# EAGLE board schützboard9 (EAGLE 4.16)
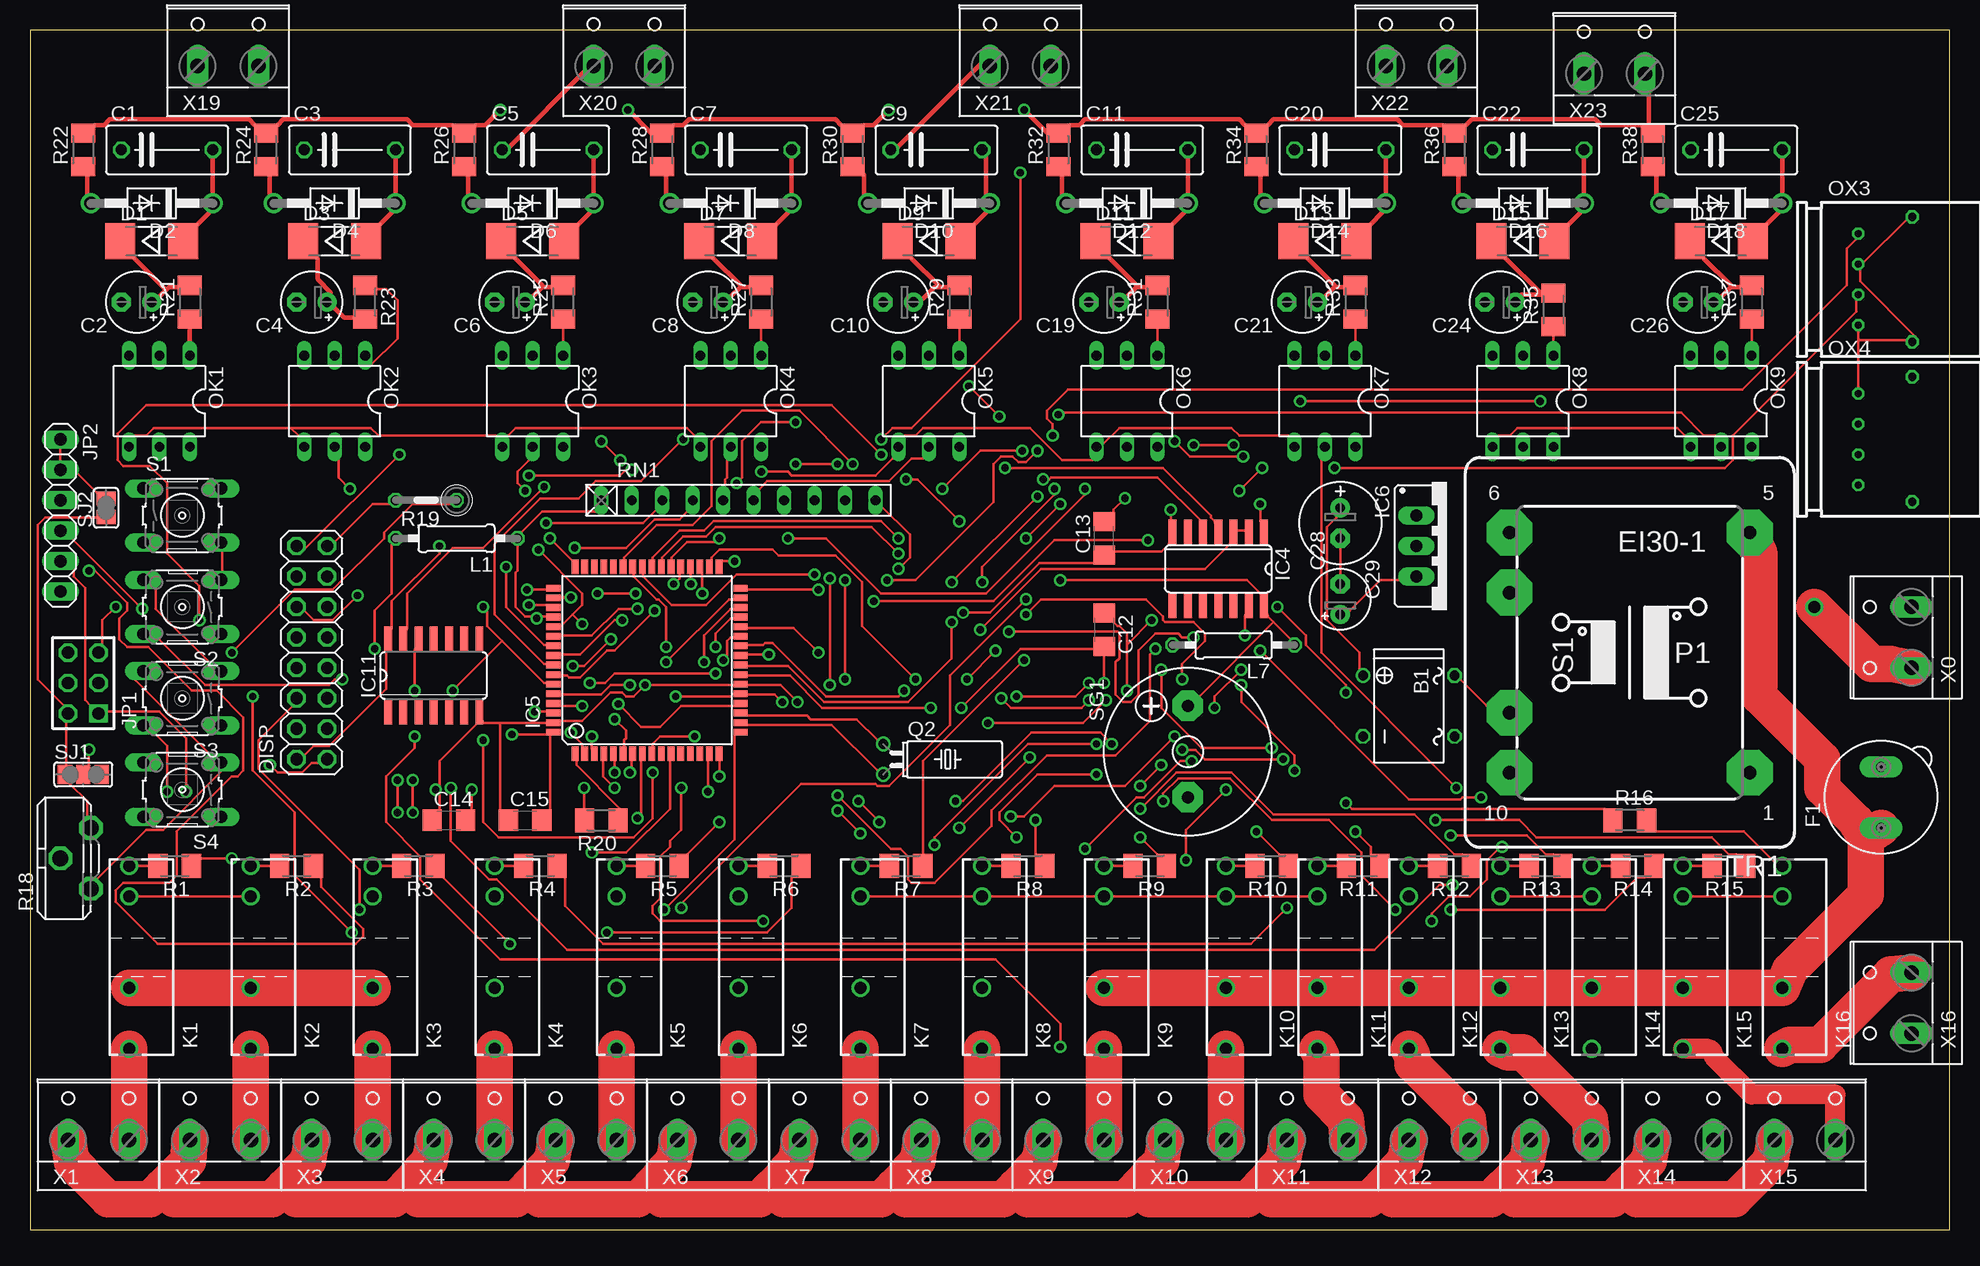
[diagram p1: board, top side]
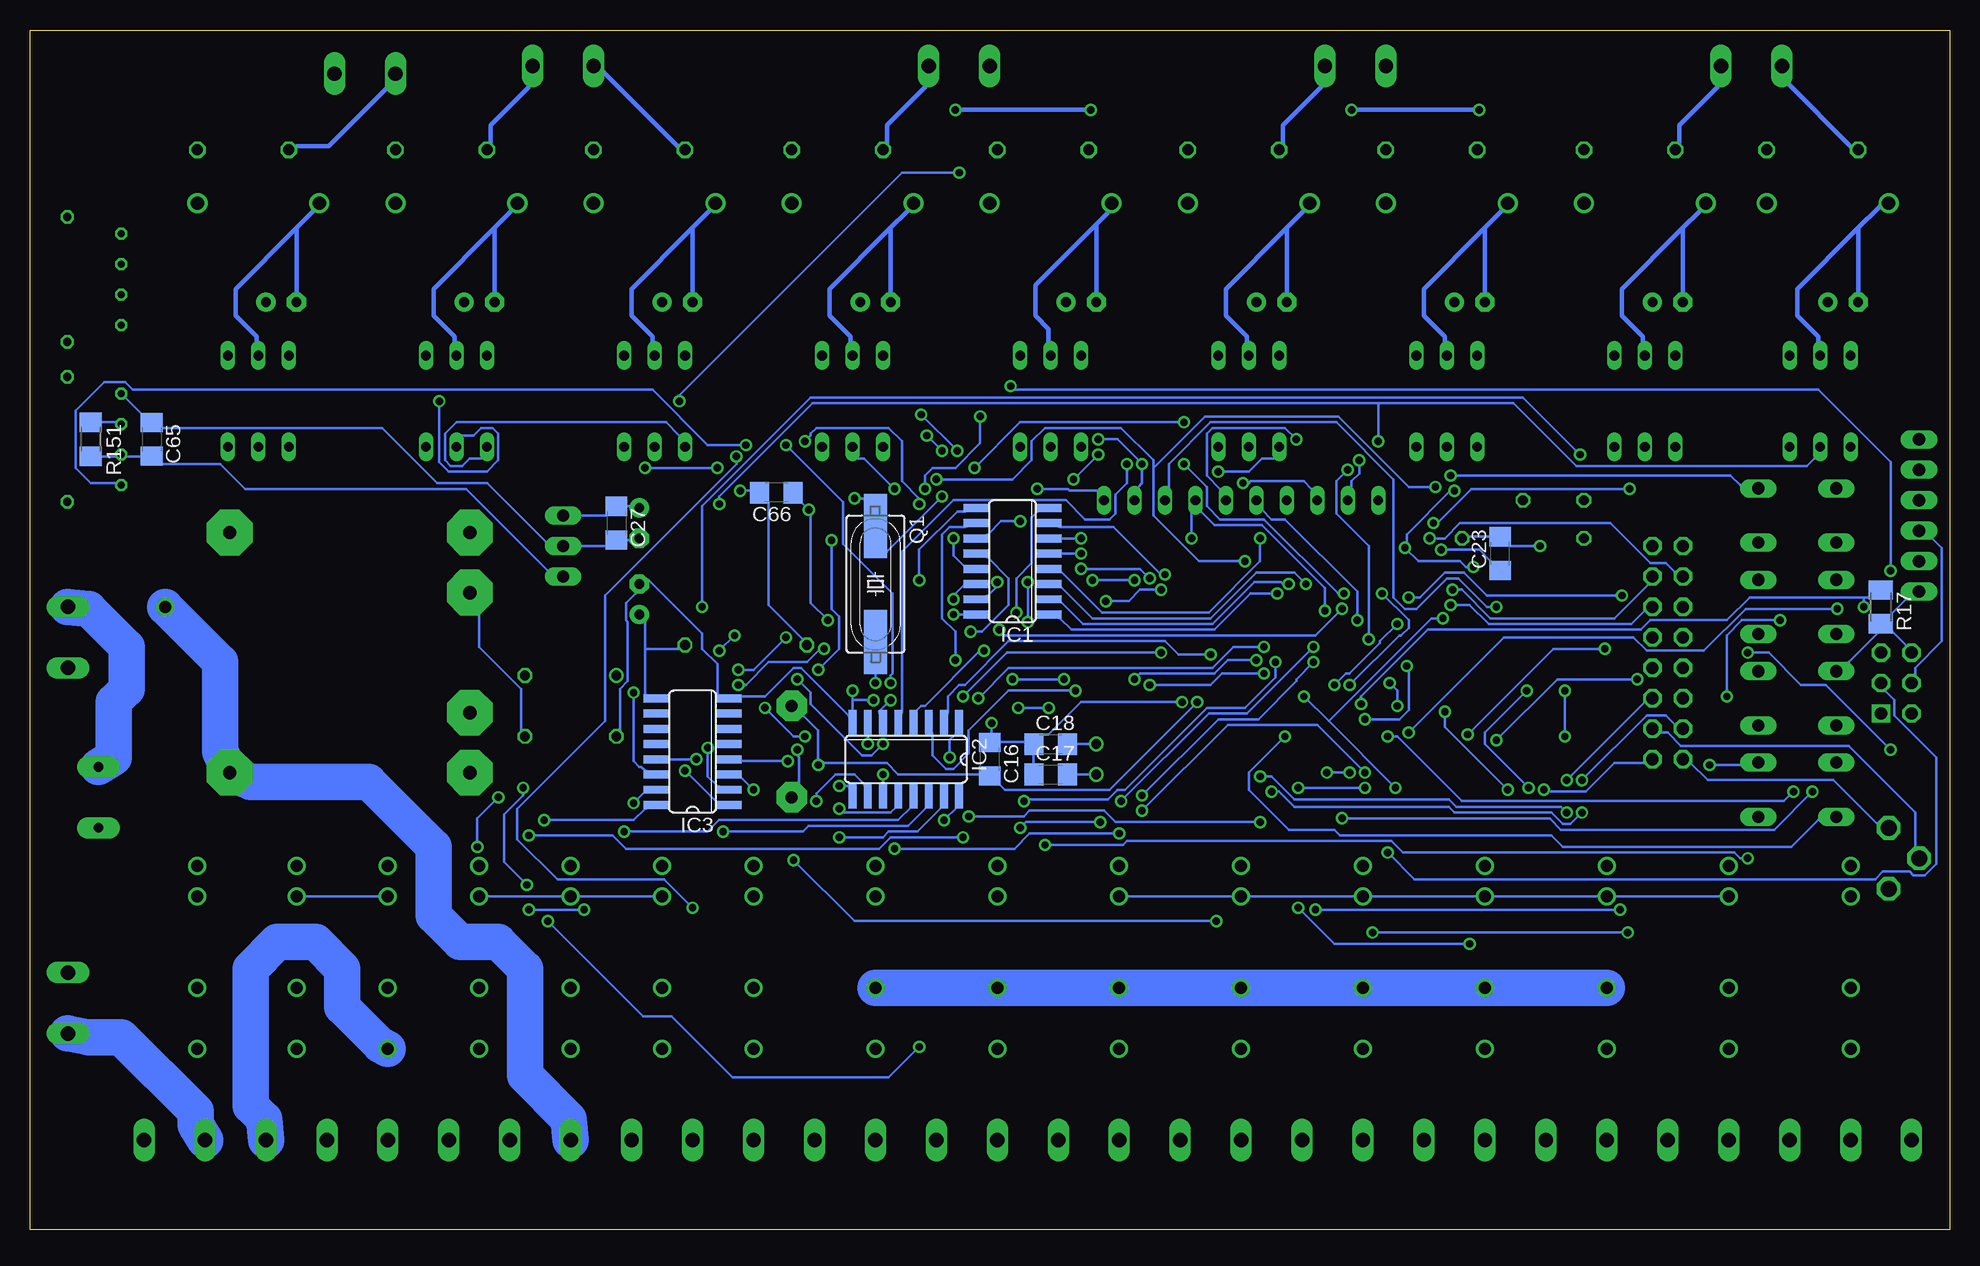
[diagram p2: board, bottom side, seen from below]

Size 160 x 100 mm. Coordinates in mm from the lower left corner, seen from the top.
Outline: 0,0 160,0 160,100 0,100 0,0
Copper layers (1*16): Top 0.035mm / dielectric 1.5mm / Bottom 0.035mm
Design rules "dusch-hmi50": minimum track width 8mil, minimum drill 24mil, track to track 8mil, track to pad 8mil, pad to pad 8mil, via to via 8mil, smd to smd 8mil, copper to edge 10mil, drill to drill 8mil, minimum pad ring 8mil, minimum via ring 8mil, stop-mask expansion 4mil, vias tented up to drill 0mil, thermal gap 10mil
Net classes: 1 supply: width 0.254 mm; 2 eib: width 0.203 mm, drill 0.508 mm; 3 230vpow: width 3.048 mm, drill 1.524 mm, clearance 1 mm; 4 230vsteuer: width 0.381 mm, drill 1.524 mm; 6 vdig: width 0.254 mm

## Footprints (pad centres in the part's own frame; a part is rotated, then mirrored left to right if it is on the bottom)
B-DIL = drill 0.813 round: + -2.54,-3.81 | drill 0.813 octagon: - 2.54,-3.81; AC1 2.54,3.81; AC2 -2.54,3.81
C075-042X103 = drill 0.914 octagon: 1 -3.81,0; 2 3.81,0
E2,5-5 = drill 0.813 pad 1.6 round: + -1.27,0 | drill 0.813 pad 1.6 octagon: - 1.27,0
C1206 = smd 1.6 x 1.8: 1 -1.4,0; 2 1.4,0
E2,5-7 = drill 0.813 pad 1.6 round: + -1.27,0 | drill 0.813 pad 1.6 octagon: - 1.27,0
MELF-MLL41 = smd 2.5 x 3: A 2.625,0; C -2.625,0
DO41-10 = drill 1.118 round: A 5.08,0; C -5.08,0
2X08 = drill 1.016 octagon: 1 -8.89,-1.27; 2 -8.89,1.27; 3 -6.35,-1.27; 4 -6.35,1.27; 5 -3.81,-1.27; 6 -3.81,1.27; 7 -1.27,-1.27; 8 -1.27,1.27; 9 1.27,-1.27; 10 1.27,1.27; 11 3.81,-1.27; 12 3.81,1.27; 13 6.35,-1.27; 14 6.35,1.27; 15 8.89,-1.27; 16 8.89,1.27
19560 = drill 0.813 pad 1.778 long: 1 -2.54,0; 2 2.54,0
SO16 = smd 0.66 x 2.032: 1 -4.445,-3.073; 2 -3.175,-3.073; 3 -1.905,-3.073; 4 -0.635,-3.073; 5 0.635,-3.073; 6 1.905,-3.073; 7 3.175,-3.073; 8 4.445,-3.073; 9 4.445,3.073; 10 3.175,3.073; 11 1.905,3.073; 12 0.635,3.073; 13 -0.635,3.073; 14 -1.905,3.073; 15 -3.175,3.073; 16 -4.445,3.073
SO14 = smd 0.66 x 2.032: 1 -3.81,-3.073; 2 -2.54,-3.073; 3 -1.27,-3.073; 4 0,-3.073; 5 1.27,-3.073; 6 2.54,-3.073; 7 3.81,-3.073; 8 3.81,3.073; 9 2.54,3.073; 10 1.27,3.073; 11 0,3.073; 12 -1.27,3.073; 13 -2.54,3.073; 14 -3.81,3.073
TQFP64 = smd 1.194 x 0.559: 1 -7.8,6; 2 -7.8,5.2; 3 -7.8,4.4; 4 -7.8,3.6; 5 -7.8,2.8; 6 -7.8,2; 7 -7.8,1.2; 8 -7.8,0.4; 9 -7.8,-0.4; 10 -7.8,-1.2; 11 -7.8,-2; 12 -7.8,-2.8; 13 -7.8,-3.6; 14 -7.8,-4.4; 15 -7.8,-5.2; 16 -7.8,-6; 33 7.8,-6; 34 7.8,-5.2; 35 7.8,-4.4; 36 7.8,-3.6; 37 7.8,-2.8; 38 7.8,-2; 39 7.8,-1.2; 40 7.8,-0.4; 41 7.8,0.4; 42 7.8,1.2; 43 7.8,2; 44 7.8,2.8; 45 7.8,3.6; 46 7.8,4.4; 47 7.8,5.2; 48 7.8,6 | smd 0.559 x 1.194: 17 -6,-7.8; 18 -5.2,-7.8; 19 -4.4,-7.8; 20 -3.6,-7.8; 21 -2.8,-7.8; 22 -2,-7.8; 23 -1.2,-7.8; 24 -0.4,-7.8; 25 0.4,-7.8; 26 1.2,-7.8; 27 2,-7.8; 28 2.8,-7.8; 29 3.6,-7.8; 30 4.4,-7.8; 31 5.2,-7.8; 32 6,-7.8; 49 6,7.8; 50 5.2,7.8; 51 4.4,7.8; 52 3.6,7.8; 53 2.8,7.8; 54 2,7.8; 55 1.2,7.8; 56 0.4,7.8; 57 -0.4,7.8; 58 -1.2,7.8; 59 -2,7.8; 60 -2.8,7.8; 61 -3.6,7.8; 62 -4.4,7.8; 63 -5.2,7.8; 64 -6,7.8
78XXS = drill 1.016 long: GND 0,-2.54; IN -2.54,-2.54; OUT 2.54,-2.54
AVR-ISP-6 = drill 1.016 square: 1 -2.54,-1.27 | drill 1.016 octagon: 2 -2.54,1.27; 3 0,-1.27; 4 0,1.27; 5 2.54,-1.27; 6 2.54,1.27
1X06 = drill 1.016 long: 1 -6.35,0; 2 -3.81,0; 3 -1.27,0; 4 1.27,0; 5 3.81,0; 6 6.35,0
S2XXEX = drill 1 round: 1 -7.62,0; 2 -2.54,0; 3 5.08,0; 4 7.62,0
0207/10 = drill 0.813 octagon: 1 -5.08,0; 2 5.08,0
DIL06 = drill 0.813 long: 1 -2.54,-3.81; 2 0,-3.81; 3 2.54,-3.81; 4 2.54,3.81; 5 0,3.81; 6 -2.54,3.81
TORX173 = drill 0.6 octagon: 1 -3.81,0; 2 -1.27,0; 3 1.27,0; 4 3.81,0 | drill 0.7 octagon: 5 5.2,4.5; 6 -5.2,4.5
TOTX173 = drill 0.6 octagon: 1 -3.81,0; 2 -1.27,0; 3 1.27,0; 4 3.81,0 | drill 0.7 octagon: 5 5.2,4.5; 6 -5.2,4.5
HC49UP = smd 5.334 x 1.93: 1 -4.826,0; 2 4.826,0
TC38H = drill 0.813 round: 1 -1.27,0; 2 1.27,0
M1206 = smd 1.6 x 2: 1 -1.4,0; 2 1.4,0
ST10 = drill 1.321 octagon: A -2.54,-1.27; E 2.54,-1.27; S 0,1.27
0207/5V = drill 0.813 octagon: 1 -2.54,0; 2 2.54,0
R1206 = smd 1.6 x 1.803: 1 -1.422,0; 2 1.422,0
RN-10 = drill 0.813 long: 1 -11.43,0; 2 -8.89,0; 3 -6.35,0; 4 -3.81,0; 5 -1.27,0; 6 1.27,0; 7 3.81,0; 8 6.35,0; 9 8.89,0; 10 11.43,0
B3F-10XX = drill 1.016 long: 1 -3.251,2.261; 2 3.251,2.261; 3 -3.251,-2.261; 4 3.251,-2.261
F/CM12P = drill 1.016 pad 2.54 octagon: + 3.81,0; - -3.81,0
SJ_2 = smd 1.168 x 1.6: 1 -1.524,0; 2 0,0; 3 1.524,0
SJ = smd 1.168 x 1.6: 1 -0.762,0; 2 0.762,0
EI30-1 = drill 1.118 pad 3.81 octagon: 1 -10.008,10.008; 5 -10.008,-10.008; 6 10.008,-10.008; 7 10.008,-5.004; 9 10.008,5.004; 10 10.008,10.008
W237-132 = drill 1.194 long: 1 -2.54,-0.635; 2 2.54,-0.635

## Placement (x,y rotation side)
B1  [B-DIL]  114.93,43.65 270 top
C1  MKS-4 47N  [C075-042X103]  11.43,90 0 top
C2  RAD 105 10/63  [E2,5-5]  8.89,77.3 180 top
C3  MKS-4 47N  [C075-042X103]  26.66,90 0 top
C4  RAD 105 10/63  [E2,5-5]  23.49,77.3 180 top
C5  MKS-4 47N  [C075-042X103]  43.18,90 0 top
C6  RAD 105 10/63  [E2,5-5]  40,77.3 180 top
C7  MKS-4 47N  [C075-042X103]  59.69,90 0 top
C8  RAD 105 10/63  [E2,5-5]  56.51,77.3 180 top
C9  MKS-4 47N  [C075-042X103]  75.56,90 0 top
C10  RAD 105 10/63  [E2,5-5]  72.38,77.3 180 top
C11  MKS-4 47N  [C075-042X103]  92.7,90 0 top
C12  [C1206]  89.53,50 270 top
C13  [C1206]  89.53,57.62 90 top
C14  [C1206]  34.92,34.12 0 top
C15  [C1206]  41.27,34.12 0 top
C16  [C1206]  80,39.2 270 bottom
C17  [C1206]  74.92,37.94 0 bottom
C18  [C1206]  74.92,40.48 0 bottom
C19  RAD 105 10/63  [E2,5-5]  89.53,77.3 180 top
C20  MKS-4 47N  [C075-042X103]  109.21,90 0 top
C21  RAD 105 10/63  [E2,5-5]  106.04,77.3 180 top
C22  MKS-4 47N  [C075-042X103]  125.72,90 0 top
C23  [C1206]  37.46,56.35 90 bottom
C24  RAD 105 10/63  [E2,5-5]  122.55,77.3 180 top
C25  MKS-4 47N  [C075-042X103]  142.23,90 0 top
C26  RAD 105 10/63  [E2,5-5]  139.06,77.3 180 top
C27  X7R-G1206 100N  [C1206]  111.12,58.89 270 bottom
C28  RAD 105 10/63  [E2,5-5]  109.21,52.54 90 top
C29  RAD 105 220/16  [E2,5-7]  109.21,58.89 270 top
C65  X7R-G1206 100N  [C1206]  149.85,65.88 270 bottom
C66  X7R-G1206 100N  [C1206]  97.78,61.43 180 bottom
D1  SMD 1N 4007  [MELF-MLL41]  10.16,82.39 0 top
D2  P6KE 440A  [DO41-10]  10.16,85.56 180 top
D3  SMD 1N 4007  [MELF-MLL41]  25.39,82.39 0 top
D4  P6KE 440A  [DO41-10]  25.39,85.56 180 top
D5  SMD 1N 4007  [MELF-MLL41]  41.91,82.39 0 top
D6  P6KE 440A  [DO41-10]  41.91,85.56 180 top
D7  SMD 1N 4007  [MELF-MLL41]  58.41,82.39 0 top
D8  P6KE 440A  [DO41-10]  58.41,85.56 180 top
D9  SMD 1N 4007  [MELF-MLL41]  74.92,82.39 0 top
D10  P6KE 440A  [DO41-10]  74.92,85.56 180 top
D11  SMD 1N 4007  [MELF-MLL41]  91.44,82.39 0 top
D12  P6KE 440A  [DO41-10]  91.44,85.56 180 top
D13  SMD 1N 4007  [MELF-MLL41]  107.94,82.39 0 top
D14  P6KE 440A  [DO41-10]  107.94,85.56 180 top
D15  SMD 1N 4007  [MELF-MLL41]  124.45,82.39 0 top
D16  P6KE 440A  [DO41-10]  124.45,85.56 180 top
D17  SMD 1N 4007  [MELF-MLL41]  140.97,82.39 0 top
D18  P6KE 440A  [DO41-10]  140.97,85.56 180 top
DISP  [2X08]  23.49,48.09 90 top
F1  [19560]  154.3,36.03 90 top
IC1  ULN2003AD  [SO16]  78.1,55.71 90 bottom
IC2  ULN2003AD  [SO16]  86.99,39.2 180 bottom
IC3  ULN2003AD  [SO16]  104.77,39.84 90 bottom
IC4  4066D  [SO14]  99.05,55.08 180 top
IC5  MEGA64-A  [TQFP64]  51.43,47.46 90 top
IC6  [78XXS]  118.1,56.98 270 top
IC11  74HC14D  [SO14]  33.65,46.19 0 top
JP1  AVR-ISP-6  [AVR-ISP-6]  4.44,45.55 90 top
JP2  [1X06]  2.54,59.52 270 top
K1  S202S12  [S2XXEX]  8.25,22.7 90 top
K2  S202S12  [S2XXEX]  18.41,22.7 90 top
K3  S202S12  [S2XXEX]  28.57,22.7 90 top
K4  S202S12  [S2XXEX]  38.73,22.7 90 top
K5  S202S12  [S2XXEX]  48.89,22.7 90 top
K6  S202S12  [S2XXEX]  59.05,22.7 90 top
K7  S202S12  [S2XXEX]  69.21,22.7 90 top
K8  S202S12  [S2XXEX]  79.37,22.7 90 top
K9  S202S12  [S2XXEX]  89.53,22.7 90 top
K10  S202S12  [S2XXEX]  99.69,22.7 90 top
K11  S202S12  [S2XXEX]  107.31,22.7 90 top
K12  S202S12  [S2XXEX]  114.93,22.7 90 top
K13  S202S12  [S2XXEX]  122.55,22.7 90 top
K14  S202S12  [S2XXEX]  130.17,22.7 90 top
K15  S202S12  [S2XXEX]  137.79,22.7 90 top
K16  S202S12  [S2XXEX]  146.04,22.7 90 top
L1  [0207/10]  35.55,57.62 180 top
L7  SMCC 47µ  [0207/10]  100.32,48.73 180 top
OK1  CNY17  [DIL06]  10.79,69.05 180 top
OK2  CNY17  [DIL06]  25.39,69.05 180 top
OK3  CNY17  [DIL06]  41.91,69.05 180 top
OK4  CNY17  [DIL06]  58.41,69.05 180 top
OK5  CNY17  [DIL06]  74.92,69.05 180 top
OK6  CNY17  [DIL06]  91.44,69.05 180 top
OK7  CNY17  [DIL06]  107.94,69.05 180 top
OK8  CNY17  [DIL06]  124.45,69.05 180 top
OK9  CNY17  [DIL06]  140.97,69.05 180 top
OX3  TORX173  [TORX173]  152.39,79.21 270 top
OX4  TOTX173  [TOTX173]  152.39,65.88 270 top
Q1  [HC49UP]  89.53,53.81 270 bottom
Q2  [TC38H]  71.11,39.2 270 top
R1  [M1206]  12.06,30.31 180 top
R2  [M1206]  22.22,30.31 180 top
R3  [M1206]  32.38,30.31 180 top
R4  [M1206]  42.54,30.31 180 top
R5  [M1206]  52.7,30.31 180 top
R6  [M1206]  62.86,30.31 180 top
R7  [M1206]  73.02,30.31 180 top
R8  [M1206]  83.18,30.31 180 top
R9  [M1206]  93.34,30.31 180 top
R10  [M1206]  103.5,30.31 180 top
R11  [M1206]  111.12,30.31 180 top
R12  [M1206]  118.74,30.31 180 top
R13  [M1206]  126.36,30.31 180 top
R14  [M1206]  133.98,30.31 180 top
R15  [M1206]  141.6,30.31 180 top
R16  [M1206]  133.34,34.12 0 top
R17  20k  [M1206]  5.71,51.91 270 bottom
R18  [ST10]  3.8,30.95 90 top
R19  [0207/5V]  33.02,60.8 180 top
R20  20k  [M1206]  47.62,34.12 180 top
R21  SMD 1/4W 6,8k  [M1206]  13.33,77.3 90 top
R22  SMD 1/4W 2,7k  [M1206]  4.44,90 90 top
R23  SMD 1/4W 6,8k  [M1206]  27.93,77.3 270 top
R24  SMD 1/4W 2,7k  [M1206]  19.68,90 90 top
R25  SMD 1/4W 6,8k  [M1206]  44.45,77.3 90 top
R26  SMD 1/4W 2,7k  [M1206]  36.19,90 90 top
R27  SMD 1/4W 6,8k  [M1206]  60.96,77.3 90 top
R28  SMD 1/4W 2,7k  [M1206]  52.7,90 90 top
R29  SMD 1/4W 6,8k  [M1206]  77.46,77.3 90 top
R30  SMD 1/4W 2,7k  [M1206]  68.57,90 90 top
R31  SMD 1/4W 6,8k  [M1206]  93.97,77.3 90 top
R32  SMD 1/4W 2,7k  [M1206]  85.72,90 90 top
R33  SMD 1/4W 6,8k  [M1206]  110.48,77.3 90 top
R34  SMD 1/4W 2,7k  [M1206]  102.23,90 90 top
R35  SMD 1/4W 6,8k  [M1206]  126.99,76.67 90 top
R36  SMD 1/4W 2,7k  [M1206]  118.74,90 90 top
R37  SMD 1/4W 6,8k  [M1206]  143.5,77.3 90 top
R38  SMD 1/4W 2,7k  [M1206]  135.25,90 90 top
R151  SMD 1/4W 8k2  [R1206]  154.94,65.88 270 bottom
RN1  [RN-10]  59.05,60.8 0 top
S1  [B3F-10XX]  12.7,59.52 0 top
S2  [B3F-10XX]  12.7,51.91 180 top
S3  [B3F-10XX]  12.7,44.28 180 top
S4  [B3F-10XX]  12.7,36.66 180 top
SG1  F/CM12P  [F/CM12P]  96.52,39.84 90 top
SJ1  [SJ_2]  4.44,37.94 0 top
SJ2  [SJ]  6.34,60.16 90 top
TR1  [EI30-1]  133.34,48.09 180 top
X0  [W237-132]  156.2,49.37 90 top
X1  [W237-132]  5.71,8.09 0 top
X2  [W237-132]  15.87,8.09 0 top
X3  [W237-132]  26.03,8.09 0 top
X4  [W237-132]  36.19,8.09 0 top
X5  [W237-132]  46.35,8.09 0 top
X6  [W237-132]  56.51,8.09 0 top
X7  [W237-132]  66.67,8.09 0 top
X8  [W237-132]  76.83,8.09 0 top
X9  [W237-132]  86.99,8.09 0 top
X10  [W237-132]  97.15,8.09 0 top
X11  [W237-132]  107.31,8.09 0 top
X12  [W237-132]  117.47,8.09 0 top
X13  [W237-132]  127.63,8.09 0 top
X14  [W237-132]  137.79,8.09 0 top
X15  [W237-132]  147.95,8.09 0 top
X16  [W237-132]  156.2,18.88 90 top
X19  [W237-132]  16.5,97.62 0 top
X20  [W237-132]  49.53,97.62 0 top
X21  [W237-132]  82.55,97.62 0 top
X22  [W237-132]  115.56,97.62 0 top
X23  [W237-132]  132.07,96.99 0 top

## Tracks (layer width: path | path; a pad name or v marks a point on that pad's centre or on a via)
+5V  (via drill 0.61)
  Top 0.203: 42.22,51.11 41.27,51.11 40.48,51.91 40.48,54.76 40.64,54.92 40.64,57.14 L1.1 40.95,58.1 42.7,59.84 47.14,59.84 RN1.1 | 42.22,51.11 43.18,51.11 IC5.52 | DISP.2 22.86,39.52 23.65,40.32 24.92,40.32 29.68,45.08 29.68,48.25 IC11.14 30.16,50.16 30.16,52.38 34.13,56.35 v34.13,56.98 | SJ2.1 5.55,59.37 1.27,59.37 0.63,58.73 0.63,45.87 2.85,43.65 JP1.2 3.01,42.38 3.01,38.73 SJ1.1 3.33,37.14 4.76,35.71 4.76,34.44 R18.E | IC6.OUT 114.14,54.13 112.55,54.13 110.01,51.59 C28.+ | v62.7,43.97 62.07,44.6 59.69,44.6 IC5.21 58.73,44.76 58.41,44.44 v53.81,44.44 | v46.19,36.82 46.19,35.08 R20.2 | v94.29,38.73 v92.55,36.98 | v85.88,54.13 101.44,54.13 102.55,53.02 IC4.14 103.18,51.11 103.66,50.63 | 103.66,50.63 105.09,49.21 L7.1 | 103.66,50.63 97.47,44.44 SG1.+ | 42.22,51.11 v42.22,50.95
  Bottom 0.203: L1.1 40.16,57.78 38.25,57.78 C23.2 36.67,56.98 v34.13,56.98 | DISP.2 21.58,38.89 20.16,37.46 9.68,37.46 6.03,33.81 R18.E | R151.2 154.14,64.45 152.87,64.45 OX4.3 151.92,64.45 150.65,64.45 C65.2 149.06,63.81 144.14,63.81 142.08,61.75 123.66,61.75 116.83,54.92 IC6.OUT | 108.74,48.41 108.74,50.63 C28.+ | 108.74,48.41 108.74,44.6 IC3.9 | v62.7,43.97 70,36.66 78.73,36.66 79.21,37.14 C16.2 80.8,37.94 87.62,37.94 88.58,38.89 93.82,38.89 v94.29,38.73 94.29,41.59 95.56,42.86 SG1.+ | 51.75,42.38 v53.81,44.44 | 51.75,42.38 v46.19,36.82 | v92.55,36.98 91.75,36.98 IC2.9 | v85.88,54.13 85.88,56.67 82.7,59.84 82.07,59.84 IC1.9 | 108.74,48.41 105.88,48.41 L7.1 | v42.22,50.95 43.18,50.95 51.75,42.38
GND  (via drill 0.61)
  Top 0.203: S3.4 8.73,45.87 14.92,39.68 S4.3 16.03,38.25 11.11,33.33 9.68,33.33 5.55,29.2 R18.A | v20,38.73 20.63,38.09 22.7,38.09 23.49,38.89 24.12,38.89 DISP.1 | 45.24,51.27 46.03,52.06 46.03,53.02 v42.38,56.67 | 45.24,51.27 44.29,50.32 44.13,50.32 IC5.53 | 39.21,42.22 37.78,42.22 IC11.7 37.3,42.22 34.13,39.05 34.13,36.66 | 39.21,42.22 43.18,42.22 IC5.63 44.13,42.38 46.03,42.38 48.41,44.76 49.37,44.76 49.68,44.44 50.32,44.44 v51.27,45.4 58.73,45.4 IC5.22 59.69,45.4 62.54,45.4 v63.97,43.97 | 34.13,36.66 34.13,34.92 C14.1 | 39.21,42.22 39.21,34.92 C15.1 | v46.03,50.48 45.24,51.27 | 45.24,51.27 | v33.81,36.66 34.13,36.66 | v95.09,60 95.09,59.05 IC4.7 94.93,57.14 94.29,56.51 90.32,56.51 C13.1 88.74,55.56 84.13,55.56 80,51.43 v77.78,51.43 | OX3.6 156.52,84.29 152.87,80.64 OX3.2 152.55,80 152.55,79.05 157.16,74.45 OX3.5 156.36,74.13 152.39,74.13 | 152.39,74.13 152.39,70.16 OX4.1 | 152.39,74.13 152.39,74.92 OX3.4 | v91.44,44.92 91.44,48.73 | 91.44,48.73 91.44,49.68 90.8,50.32 90.64,50.32 90.32,50.63 C12.1 | C29.- 109.21,56.83 109.21,54.6 C28.- | 91.44,48.73 v93.5,50.79 | v79.85,42.22 87.78,42.22 v89.69,44.13
  Bottom 0.203: R17.2 4.76,49.84 3.49,48.57 JP1.6 | S3.4 8.41,47.3 5.87,49.84 R17.2 | v20,38.73 17.46,38.73 S4.3 | JP2.6 3.65,52.54 4.92,51.27 R17.2 | v42.38,56.67 39.21,56.67 38.25,55.71 C23.1 | C17.1 76.35,38.73 76.35,39.68 C18.1 | C18.1 76.99,40.63 79.21,40.63 C16.1 79.85,41.27 v79.85,42.22 | v63.97,43.97 72.38,43.97 75.08,41.27 75.56,41.27 C18.1 | v46.03,50.48 47.46,49.05 47.46,48.89 50,46.35 50.32,46.35 v51.27,45.4 | v33.81,36.66 33.65,36.51 30.32,36.51 27.93,38.89 25.39,38.89 DISP.1 | C66.1 95.72,60.64 v95.09,60 94.93,59.52 94.93,52.22 v93.5,50.79 | v77.78,51.43 77.78,54.29 76.51,55.56 76.51,59.37 76.04,59.84 IC1.8 | OX4.1 150.65,67.94 C65.1 149.06,66.83 130.65,66.83 126.04,62.22 121.91,62.22 116.99,57.3 IC6.GND 114.14,56.98 111.91,56.98 C27.2 110.33,57.46 110.01,57.46 C29.- | 91.44,44.13 91.44,43.17 IC2.8 91.75,42.86 95.72,46.82 96.36,46.82 98.74,44.44 100.8,44.44 IC3.8 102.71,44.6 102.71,47.14 103.98,48.41 103.98,49.68 108.42,54.13 C28.- 109.53,53.02 110.33,52.22 110.33,50.79 110.17,50.63 110.17,45.71 110.8,45.08 110.8,41.59 B1.- | 91.44,44.13 v91.44,44.92 | v89.69,44.13 91.44,44.13
N$1
  Top 0.203: SJ2.2 5.55,61.43 3.96,63.02 JP2.2 2.54,63.97 2.54,65.24 JP2.1
N$2  (via drill 0.61)
  Top 0.203: v56.03,53.02 56.03,54.76 IC5.35
  Bottom 0.203: v56.03,53.02 58.26,53.02 61.27,50 73.18,50 74.13,50.95 IC1.1
N$3  (via drill 0.61)
  Top 0.203: v55.08,53.81 55.08,54.76 IC5.36
  Bottom 0.203: v55.08,53.81 55.56,53.81 55.72,53.97 57.94,53.97 61.43,50.48 72.23,50.48 74.13,52.38 IC1.2
N$4  (via drill 0.61)
  Top 0.203: v53.65,53.81 54.13,54.29 54.13,54.76 IC5.37
  Bottom 0.203: v53.65,53.81 54.61,54.76 57.78,54.76 61.59,50.95 71.43,50.95 74.13,53.65 IC1.3
N$5  (via drill 0.61)
  Top 0.203: v57.46,57.62 57.15,57.3 54.76,57.3 53.49,56.03 53.49,55.71 IC5.38
  Bottom 0.203: v57.46,57.62 57.46,55.71 61.75,51.43 70.64,51.43 74.13,54.92 IC1.4
N$6  (via drill 0.61)
  Top 0.203: v16.82,30.95 14.12,30.95 R1.1 | v75.4,32.06 75.4,32.7 83.18,40.48 v88.89,40.48 | v96.04,45.87 96.04,47.14 97.94,49.05 97.94,49.68 96.99,50.63 94.61,50.63 94.45,50.79 94.45,51.11 93.02,52.54 84.29,52.54 v83.02,51.27
  Bottom 0.203: v16.82,30.95 17.46,30.95 17.93,31.43 45.56,31.43 46.51,32.38 68.57,32.38 68.89,32.06 v75.4,32.06 | v88.89,40.48 89.85,39.52 90.64,39.52 94.93,43.81 94.93,44.76 v96.04,45.87 | v83.02,51.27 82.07,51.27 IC1.16
N$7  (via drill 0.61)
  Top 0.203: v4.92,54.92 5.39,54.92 8.09,52.22 8.09,51.59 7.46,50.95 7.46,49.21 8.09,48.57 9.84,48.57 13.49,44.92 15.55,44.92 17.77,42.7 17.77,38.25 17.3,37.78 16.82,37.78 12.22,33.17 12.22,29.52 11.58,28.89 7.77,28.89 7.14,28.25 7.14,27.3 10.63,23.81 27.14,23.81 27.78,24.44 27.78,25.08 24.28,28.57 24.28,29.36 R2.1 | v78.26,70.32 v80.8,67.78 | v85.4,61.75 85.4,61.27 79.37,55.24 v79.37,53.97
  Bottom 0.203: v4.92,54.92 4.92,63.97 10.95,70 77.94,70 v78.26,70.32 | v80.8,67.78 80.8,65.56 82.86,63.49 84.77,63.49 85.4,62.86 v85.4,61.75 | v79.37,53.97 79.37,53.65 80.16,52.86 IC1.15
N$8  (via drill 0.61)
  Top 0.203: v40,23.81 34.44,29.36 R3.1 | v54.29,26.82 54.29,27.14 64.29,37.14 70.48,37.14 70.64,36.98 71.59,36.98 76.67,42.06 76.67,46.19 v83.02,52.54
  Bottom 0.203: v40,23.81 51.27,23.81 v54.29,26.82 | v83.02,52.54 83.02,52.86 82.07,53.81 IC1.14
N$9  (via drill 0.61)
  Top 0.203: v104.77,26.82 101.75,23.81 47.78,23.81 44.6,26.98 44.6,29.36 R4.1 | v101.12,64.45 96.67,64.45 v95.4,65.72 | v85.88,60.48 v83.02,57.62
  Bottom 0.203: v104.77,26.82 107.15,29.2 116.04,29.2 119.38,32.54 119.38,35.08 112.07,42.38 112.07,52.86 101.12,63.81 v101.12,64.45 | v95.4,65.72 94.93,66.19 94.93,66.35 94.45,66.83 88.42,66.83 87.31,65.72 87.31,62.38 85.88,60.95 v85.88,60.48 | v83.02,57.62 83.02,56.19 82.07,55.24 IC1.13
N$10  (via drill 0.61)
  Top 0.203: v57.46,33.97 54.76,31.27 R5.1 | v81.75,34.44 82.86,34.44 85.4,36.98 91.28,36.98 v95.4,41.11 | v98.74,43.49 98.74,44.44 v100.96,46.67 | v96.99,49.37 96.04,49.37 95.72,49.68 93.82,49.68 92.39,48.25 92.39,44.6 91.75,43.97 91.12,43.97 90.48,44.6 90.48,47.3 90.8,47.62 90.8,49.68 90.64,49.84 v81.59,49.84
  Bottom 0.203: v57.46,33.97 69.53,33.97 70.48,34.92 76.67,34.92 77.15,34.44 v81.75,34.44 | v95.4,41.11 96.36,41.11 v98.74,43.49 | v100.96,46.67 99.69,46.67 v96.99,49.37 | v81.59,49.84 80.64,49.84 78.42,52.06 78.42,54.29 80.16,56.03 IC1.12
N$11  (via drill 0.61)
  Top 0.203: v48.1,24.76 61.43,24.76 63.5,26.82 63.5,29.36 R6.1 | v26.82,24.76 22.06,29.52 22.06,34.76 18.57,38.25 v18.57,44.44 | v14.12,50.79 14.12,53.65 11.43,56.35 11.43,62.22 10,63.65 7.77,63.65 7.3,64.13 7.3,66.35 9.68,68.73 66.83,68.73 v70.96,64.61 | v73.02,62.54 73.97,62.54 v77.46,59.05
  Bottom 0.203: v26.82,24.76 v48.1,24.76 | v18.57,44.44 18.57,49.52 17.3,50.79 v14.12,50.79 | v70.96,64.61 v73.02,62.54 | v77.46,59.05 79.05,59.05 80.16,57.94 IC1.11
N$12  (via drill 0.61)
  Top 0.203: v82.86,47.46 74.45,39.05 74.45,31.27 R7.1
  Bottom 0.203: v82.86,47.46 82.86,49.84 83.97,50.95 83.97,57.94 83.34,58.57 82.07,58.57 IC1.10
N$13  (via drill 0.61)
  Top 0.203: v83.81,34.12 83.81,31.27 R8.1
  Bottom 0.203: v83.81,34.12 82.7,35.24 IC2.16
N$14  (via drill 0.61)
  Top 0.203: v92.55,32.7 93.97,31.27 R9.1
  Bottom 0.203: v92.55,32.7 88.89,32.7 88.42,33.17 86.04,33.17 83.97,35.24 IC2.15
N$15  (via drill 0.61)
  Top 0.203: v102.23,33.17 104.13,31.27 R10.1
  Bottom 0.203: v102.23,33.17 95.56,33.17 95.09,33.65 86.83,33.65 85.24,35.24 IC2.14
N$16  (via drill 0.61)
  Top 0.203: v110.48,33.17 111.75,31.9 111.75,31.27 R11.1
  Bottom 0.203: v110.48,33.17 103.5,33.17 102.55,34.12 87.62,34.12 86.51,35.24 IC2.13
N$17
  Top 0.203: R1.2 10,30.31 8.89,30.31 K1.4
N$18
  Top 0.203: R2.2 20.16,30.31 19.04,30.31 K2.4
N$19
  Top 0.203: R3.2 30.32,30.31 29.2,30.31 K3.4
N$20
  Top 0.203: R4.2 40.48,30.31 39.37,30.31 K4.4
N$21
  Top 0.203: R5.2 50.64,30.31 49.53,30.31 K5.4
N$22
  Top 0.203: R6.2 60.8,30.31 59.69,30.31 K6.4
N$23
  Top 0.203: R7.2 70.96,30.31 69.84,30.31 K7.4
N$24
  Top 0.203: R8.2 81.12,30.31 80,30.31 K8.4
N$25
  Top 0.203: R9.2 91.28,30.31 90.16,30.31 K9.4
N$26
  Top 0.203: R10.2 101.44,30.31 100.32,30.31 K10.4
N$27
  Top 0.203: R11.2 109.06,30.31 107.94,30.31 K11.4
N$28  (via drill 0.61)
  Top 0.203: v92.55,35.08 95.56,38.09 100.17,38.09 103.66,34.6 115.41,34.6 118.74,31.27 119.38,31.27 R12.1
  Bottom 0.203: v92.55,35.08 92.23,34.76 88.26,34.76 87.78,35.24 IC2.12
N$29
  Top 0.203: R12.2 116.68,30.31 115.56,30.31 K12.4
N$30  (via drill 0.61)
  Top 0.203: v104.45,39.2 97.94,39.2 97.15,40 v96.04,40
  Bottom 0.203: v104.45,39.2 106.83,39.2 IC3.13 | v96.04,40 96.04,39.52 95.88,39.36 95.88,37.14 SG1.-
N$31  (via drill 0.61)
  Top 0.203: v118.42,32.85 124.77,32.85 126.36,31.27 126.99,31.27 R13.1 | v82.23,32.7 80.8,34.12 80.8,34.76 83.97,37.94 v88.89,37.94
  Bottom 0.203: v118.42,32.85 111.44,32.85 110.33,31.74 89.21,31.74 88.26,32.7 v82.23,32.7 | v88.89,37.94 88.89,37.14 IC2.11
N$32
  Bottom 3.048: F1.2 153.03,39.36 153.03,43.97 151.92,45.08 151.92,48.57 155.09,51.75 X0.2
N$33  (via drill 0.61)
  Top 0.203: v118.42,26.66 131.28,26.66 133.98,29.36 134.62,29.36 R14.1 | v113.82,26.66 110.96,29.52 110.96,31.43 108.26,34.12 103.5,34.12 100.01,37.62 95.72,37.62 94.45,36.35 v94.45,35.71
  Bottom 0.203: v113.82,26.66 v118.42,26.66 | v94.45,35.71 94.45,36.35 92.86,37.94 91.28,37.94 90.48,37.14 IC2.10
N$34
  Top 3.048: K1.1 8.25,14.44 8.25,9.2 X1.2
N$35
  Top 3.048: K2.1 18.41,14.44 18.41,9.2 X2.2
N$36
  Top 3.048: K3.1 28.57,14.44 28.57,9.2 X3.2
N$37
  Top 3.048: K4.1 38.73,14.44 38.73,9.2 X4.2
N$38
  Top 3.048: K5.1 48.89,14.44 48.89,9.2 X5.2
N$39
  Top 3.048: K6.1 59.05,14.44 59.05,9.2 X6.2
N$40
  Top 3.048: K7.1 69.21,14.44 69.21,9.2 X7.2
N$41
  Top 3.048: K8.1 79.37,14.44 79.37,9.2 X8.2
N$42
  Top 3.048: K11.1 107.63,14.44 107.63,11.27 109.69,9.2 X11.2
N$43
  Top 3.048: K12.1 115.25,14.44 115.25,13.81 119.85,9.2 X12.2
N$44  (via drill 0.61)
  Top 0.203: v117.15,34.12 124.14,34.12 125.57,32.7 140.17,32.7 141.6,31.27 142.23,31.27 R15.1
  Bottom 0.203: v117.15,34.12 109.69,34.12 108.74,35.08 IC3.16
N$45
  Top 3.048: K10.1 99.69,14.44 99.69,9.2 X10.2
N$46
  Top 3.048: K9.1 89.53,14.44 89.53,9.2 X9.2
N$47  (via drill 0.61)
  Top 0.203: v109.69,35.55 110.17,35.08 131.28,35.08 R16.1
  Bottom 0.203: v109.69,35.55 108.74,36.51 IC3.15
N$48  (via drill 0.61)
  Top 0.203: v46.83,31.43 49.68,31.43 53.34,35.08 53.34,39.2 IC5.11
  Bottom 0.203: v46.83,31.43 44.6,29.2 6.19,29.2 5.55,29.84 3.33,29.84 3.01,29.52 2.06,29.52 1.11,30.47 1.11,39.36 4.6,42.86 4.6,44.13 5.39,44.92 JP1.3
N$49  (via drill 0.61)
  Top 0.203: v72.38,56.35 70.16,58.57 57.15,58.57 56.35,57.78 54.45,57.78 52.7,56.03 52.7,55.71 IC5.39
  Bottom 0.203: v72.38,56.35 74.13,56.35 IC1.5
N$50  (via drill 0.61)
  Top 0.203: v72.38,57.62 70.96,59.05 56.99,59.05 56.19,58.25 54.13,58.25 51.91,56.03 51.91,55.71 IC5.40
  Bottom 0.203: v72.38,57.62 74.13,57.62 IC1.6
N$51  (via drill 0.61)
  Top 0.203: v65.4,54.6 58.89,54.6 56.35,52.06 53.49,52.06 51.11,54.45 51.11,54.76 IC5.41
  Bottom 0.203: v65.4,54.6 65.72,54.6 69.69,58.57 74.13,58.57 IC1.7
N$52
  Top 0.203: R13.2 124.3,30.31 123.19,30.31 K13.4
N$53
  Top 0.203: R14.2 131.92,30.31 130.81,30.31 K14.4
N$54
  Top 0.203: R15.2 139.54,30.31 138.42,30.31 K15.4
N$55  (via drill 0.61)
  Top 0.203: v61.59,47.94 59.69,47.94 IC5.25
  Bottom 0.203: v61.59,47.94 64.29,47.94 65.4,49.05 78.42,49.05 82.07,45.4 82.55,45.4 83.5,44.44 83.5,43.17 IC2.2
N$56
  Top 0.203: R16.2 135.41,33.17 142.87,33.17 145.41,30.63 K16.4
N$57  (via drill 0.61)
  Top 0.203: v46.83,41.11 46.83,40.16 IC5.3 | v13.01,36.51 13.01,40.95 10.79,43.17 6.34,43.17 JP1.1 5.08,43.65 4.6,44.13 4.6,53.49 3.65,54.45 3.65,55.08 JP2.5
  Bottom 0.203: v46.83,41.11 46.03,41.11 40.64,35.71 13.81,35.71 v13.01,36.51
N$58
  Top 0.203: K13.3 123.19,27.77 129.53,27.77 K14.3 | K16.3 145.41,27.77 138.42,27.77 K15.3 | K11.3 106.67,27.77 100.32,27.77 K10.3 99.05,27.77 90.16,27.77 K9.3 88.89,27.77 80,27.77 K8.3 78.73,27.77 69.84,27.77 K7.3 | K1.3 8.89,27.77 17.77,27.77 K2.3
  Bottom 0.203: K15.3 137.16,27.77 130.81,27.77 K14.3 | K11.3 107.94,27.77 114.3,27.77 K12.3 115.56,27.77 121.91,27.77 K13.3 | K2.3 19.04,27.77 27.93,27.77 K3.3 29.2,27.77 38.1,27.77 K4.3 39.37,27.77 48.26,27.77 K5.3 49.53,27.77 58.41,27.77 K6.3 59.69,27.77 68.57,27.77 K7.3
N$59
  Top 3.048: K1.2 8.89,20.15 17.77,20.15 K2.2 19.84,20.15 27.93,20.15 K3.2 | 153.03,32.7 153.03,27.93 146.68,21.58 K16.2 145.41,20.15 139.22,20.15 K15.2 137.16,20.15 131.6,20.15 K14.2 129.53,20.15 123.98,20.15 K13.2 121.91,20.15 116.36,20.15 K12.2 114.3,20.15 108.74,20.15 K11.2 106.67,20.15 100.32,20.15 K10.2 98.26,20.15 90.16,20.15 K9.2 | 153.03,32.7 F1.1 | TR1.5 144.14,56.35 144.14,44.44 149.38,39.2 149.38,36.82 152.24,33.97 153.03,32.7
  Bottom 3.048: K9.2 88.89,20.15 80.8,20.15 K8.2 78.73,20.15 70.64,20.15 K7.2 68.57,20.15 60.48,20.15 K6.2 58.41,20.15 50.32,20.15 K5.2 48.26,20.15 39.37,20.15 K4.2 37.3,20.15 29.2,20.15 K3.2
N$60
  Top 1.676: X15.2 150.49,11.27 143.5,11.27 140.33,14.44 arc90 139.69,15.08 K15.1
N$61
  Top 3.048: K16.1 146.68,15.39 149.22,15.39 155.09,21.27 X16.2
N$62  (via drill 1)
  Top 3.048: v148.74,51.91 153.51,47.14 155.09,47.14 X0.1 | 11.03,3.57 13.17,5.71 X2.1 | 11.03,3.57 10,2.53 6.5,2.53 4.28,4.76 4.28,4.92 3.49,5.71 X1.1 | 21.19,3.57 20.16,2.53 12.06,2.53 11.03,3.57 | 21.19,3.57 22.38,4.76 22.38,4.92 23.17,5.71 X3.1 | 31.35,3.57 30.32,2.53 22.22,2.53 21.19,3.57 | 31.35,3.57 32.54,4.76 32.54,4.92 33.33,5.71 X4.1 | 41.51,3.57 40.48,2.53 32.38,2.53 31.35,3.57 | 41.51,3.57 42.7,4.76 42.7,4.92 43.49,5.71 X5.1 | 51.67,3.57 50.64,2.53 42.54,2.53 41.51,3.57 | 51.67,3.57 52.86,4.76 52.86,4.92 53.65,5.71 X6.1 | 61.83,3.57 60.8,2.53 52.7,2.53 51.67,3.57 | 61.83,3.57 63.02,4.76 63.02,4.92 63.81,5.71 X7.1 | 71.99,3.57 70.96,2.53 62.86,2.53 61.83,3.57 | 71.99,3.57 73.18,4.76 73.18,4.92 73.97,5.71 X8.1 | 82.15,3.57 81.12,2.53 73.02,2.53 71.99,3.57 | 82.15,3.57 83.34,4.76 83.34,4.92 84.13,5.71 X9.1 | 92.31,3.57 91.28,2.53 83.18,2.53 82.15,3.57 | 92.31,3.57 93.5,4.76 93.5,4.92 94.29,5.71 X10.1 | 102.47,3.57 101.44,2.53 93.34,2.53 92.31,3.57 | 102.47,3.57 103.66,4.76 103.66,4.92 104.45,5.71 X11.1 | 112.63,3.57 111.6,2.53 103.5,2.53 102.47,3.57 | 112.63,3.57 113.82,4.76 113.82,4.92 114.61,5.71 X12.1 | 122.79,3.57 121.76,2.53 113.66,2.53 112.63,3.57 | 122.79,3.57 123.98,4.76 123.98,4.92 124.77,5.71 X13.1 | 132.95,3.57 131.92,2.53 123.82,2.53 122.79,3.57 | 132.95,3.57 134.14,4.76 134.14,4.92 134.93,5.71 X14.1 | X15.1 145.09,5.71 144.3,4.92 144.3,4.76 142.08,2.53 133.98,2.53 132.95,3.57
  Bottom 3.048: v148.74,51.91 144.14,47.3 144.14,39.84 TR1.1 141.6,37.3 131.76,37.3 126.36,31.9 126.36,26.19 124.14,23.96 120.96,23.96 118.74,21.74 118.74,12.85 115.09,9.2 X12.1 | X15.1 146.2,8.73 146.2,9.84 152.39,16.03 155.09,16.03 X16.1
N$63
  Bottom 3.048: K14.1 130.81,15.39 133.98,18.57 133.98,21.74 136.2,23.96 139.38,23.96 141.6,21.74 141.6,10.31 140.49,9.2 X14.2
N$64
  Top 3.048: K13.1 123.19,14.76 124.45,14.76 130.01,9.2 X13.2
N$65  (via drill 0.61)
  Top 0.203: v72.86,44.92 72.38,44.44 66.35,44.44 61.91,48.89 61.27,48.89 61.11,48.73 59.69,48.73 IC5.26
  Bottom 0.203: v72.86,44.92 78.42,44.92 81.75,41.59 81.75,39.68 83.02,38.41 83.66,38.41 84.77,39.52 84.77,41.27 IC2.3
N$66  (via drill 0.61)
  Top 0.203: v65.72,48.09 63.65,50.16 59.69,50.16 IC5.28 | v82.23,44.44 87.15,44.44 v88.26,45.55 | v96.99,65.4 v100.32,65.4
  Bottom 0.203: v65.72,48.09 78.58,48.09 v82.23,44.44 | v88.26,45.55 88.26,46.19 88.1,46.35 88.1,53.02 92.23,57.14 92.23,60.64 v96.99,65.4 | v100.32,65.4 103.5,65.4 108.1,70 151.44,70 152.08,70.64 153.82,70.64 156.2,68.26 156.2,63.49 154.94,62.22 152.87,62.22 OX4.4
N$67  (via drill 0.61)
  Top 0.203: v57.78,47.46 58.1,47.78 58.1,49.05 58.41,49.37 58.73,49.37 IC5.27 | v67.94,45.87 v67.94,54.13 | v71.43,54.13 73.81,54.13 80.32,60.64 80.32,63.81 80.96,64.45 81.91,64.45 82.39,63.97 83.02,63.97 v83.97,64.92 | v85.24,66.19 85.24,67.14 84.77,67.62 84.77,68.26 86.51,70 142.71,70 151.44,78.73 151.44,81.75 152.24,82.54 OX3.1
  Bottom 0.203: v57.78,47.46 60.16,47.46 61.27,46.35 67.46,46.35 v67.94,45.87 | v67.94,54.13 v71.43,54.13 | v83.97,64.92 v85.24,66.19
N$68  (via drill 0.61)
  Top 0.203: v49.05,43.81 50.95,41.9 52.54,41.9 54.29,43.65 58.73,43.65 IC5.20 | v7.14,51.91 6.03,50.79 6.03,48.73 JP1.5
  Bottom 0.203: v49.05,43.81 49.05,44.44 43.49,50 25.71,50 24.92,50.79 18.57,50.79 16.66,52.7 7.14,52.7 | 7.14,52.7 6.66,52.7 R17.1 | v7.14,51.91 7.14,52.7
N$69  (via drill 0.61)
  Top 0.203: v57.15,48.57 57.15,49.68 58.41,50.95 58.73,50.95 IC5.29 | v80.96,44.28 81.75,43.49 87.62,43.49 v88.26,44.13
  Bottom 0.203: v57.15,48.57 59.69,48.57 61.43,46.82 78.42,46.82 v80.96,44.28 | v88.26,44.13 89.21,43.17 IC2.6
N$70  (via drill 0.61)
  Top 0.203: v56.19,47.3 56.19,49.52 58.41,51.75 58.73,51.75 IC5.30 | v77.15,35.71 77.78,35.71 83.5,41.43 89.21,41.43 v90.16,40.48
  Bottom 0.203: v56.19,47.3 56.19,46.03 58.73,43.49 61.91,43.49 68.73,36.66 69.37,36.66 70.16,35.87 76.99,35.87 v77.15,35.71 | v90.16,40.48 90.16,41.27 IC2.7
N$71  (via drill 0.61)
  Top 0.203: v53.02,48.57 53.02,51.91 52.38,52.54 52.22,52.54 50.32,54.45 50.32,54.76 IC5.42 | v69.05,35.71 v70.8,33.97 | v77.46,33.49 v83.34,39.36
  Bottom 0.203: v53.02,48.57 58.57,43.02 61.75,43.02 v69.05,35.71 | v70.8,33.97 76.99,33.97 v77.46,33.49 | v83.34,39.36 83.34,40.79 82.86,41.27 IC2.1
N$72  (via drill 0.61)
  Top 0.203: v53.02,47.3 58.26,52.54 58.73,52.54 IC5.31 | v67.3,36.19 71.75,31.74 72.54,31.74 73.18,31.11 73.18,29.2 73.5,28.89 75.4,28.89 80.16,33.65 80.16,34.92 84.77,39.52 90.48,39.52 93.34,42.38 93.34,47.94 v93.82,48.41 | v100.96,45.4 100.96,43.97 105.41,39.52 v105.41,38.25
  Bottom 0.203: v53.02,47.3 54.45,45.87 54.45,45.71 57.62,42.54 60.96,42.54 v67.3,36.19 | v93.82,48.41 94.13,48.41 95.24,47.3 98.42,47.3 100.32,45.4 v100.96,45.4 | v105.41,38.25 102.71,35.55 IC3.1
N$73
  Top 0.203: IC5.19 59.69,42.86 64.77,42.86 65.08,42.54 68.89,42.54 70.64,40.79 Q2.1
  Bottom 0.203: C18.2 72.86,40.48 71.59,40.48 Q2.1
N$74  (via drill 0.61)
  Top 0.203: v65.72,53.33 59.69,53.33 IC5.32 | v70.32,52.38 80.32,52.38 85.4,57.46 v93.18,57.46 | v94.29,46.67 94.29,43.49 97.63,40.16 v103.5,40.16
  Bottom 0.203: v65.72,53.33 67.46,53.33 68.42,52.38 v70.32,52.38 | v93.18,57.46 93.18,51.75 92.55,51.11 92.55,48.41 v94.29,46.67 | v103.5,40.16 103.5,37.78 102.71,36.98 IC3.2
N$75  (via drill 0.61)
  Top 0.203: v48.73,38.09 48.73,39.2 IC5.5 | v67.3,34.92 v69.21,33.01 | v87.94,31.74 92.23,36.03 92.86,36.03 95.88,39.05 v96.83,39.05
  Bottom 0.203: v48.73,38.09 52.7,42.06 60.16,42.06 v67.3,34.92 | v69.21,33.01 76.67,33.01 77.94,31.74 v87.94,31.74 | v96.83,39.05 100.8,39.05 IC3.4
N$76  (via drill 0.61)
  Top 0.203: v48.73,36.82 47.78,37.78 47.78,39.2 IC5.4 | v54.29,36.82 54.29,33.33 53.34,32.38 53.34,31.9 52.54,31.11 52.54,27.62 51.91,26.98 51.91,26.35 52.54,25.71 v61.11,25.71 | v96.36,30.79 96.36,33.33 v99.69,36.66
  Bottom 0.203: v54.29,36.82 v48.73,36.82 | v61.11,25.71 91.28,25.71 v96.36,30.79 | v99.69,36.66 100.8,37.78 IC3.3
N$77  (via drill 0.61)
  Top 0.203: 21.74,66.83 10.31,66.83 9.68,66.19 8.73,66.19 OK1.4 | 21.74,66.83 22.38,66.19 OK2.4 | 21.74,66.83 28.41,66.83 29.05,66.19 38.89,66.19 OK3.4 39.84,66.19 40.48,66.83 54.76,66.83 55.4,66.19 OK4.4 | OK8.4 122.39,66.19 123.34,66.19 123.98,66.83 137.31,66.83 137.95,66.19 OK9.4 | OK7.4 104.93,66.19 100.8,66.19 100.17,66.83 90.8,66.83 89.37,65.4 OK6.4 88.58,64.13 86.04,64.13 83.34,66.83 74.45,66.83 73.81,66.19 72.86,66.19 OK5.4 71.91,64.29 70.48,62.86 63.5,62.86 63.18,63.18 v60.96,63.18
  Bottom 0.203: OK8.4 122.39,64.29 123.34,64.29 123.98,63.65 124.93,63.65 125.41,64.13 125.41,66.35 124.45,67.3 106.99,67.3 105.88,66.19 OK7.4 | v60.96,63.18 58.41,63.18 57.3,64.29 56.35,64.29 OK4.4
N$78  (via drill 0.61)
  Top 0.203: v102.55,60.48 102.55,59.05 IC4.1 | v47.62,65.72 v49.21,64.13
  Bottom 0.203: v102.55,60.48 102.55,61.11 94.77,68.89 47.62,68.89 | 47.62,68.89 36.35,68.89 31.11,63.65 11.9,63.65 11.27,64.29 OK1.5 | v49.21,64.13 49.21,63.02 49.84,62.38 49.84,61.91 RN1.2 | 47.62,68.89 v47.62,65.72
N$79  (via drill 0.61)
  Top 0.203: v81.27,63.49 94.45,63.49 98.42,59.52 98.42,59.37 98.74,59.05 IC4.4 | v63.81,67.3 60.96,67.3 59.37,65.72 59.37,62.7 v58.89,62.22 | v26.66,61.75 25.71,62.7 25.71,64.13 OK2.5 | v43.02,58.89 51.11,58.89 52.22,60 RN1.3
  Bottom 0.203: v81.27,63.49 77.46,67.3 v63.81,67.3 | v58.89,62.22 58.41,62.22 58.26,62.38 53.81,62.38 53.18,61.75 RN1.3 | v26.66,61.75 39.84,61.75 42.7,58.89 v43.02,58.89
N$80  (via drill 0.61)
  Top 0.203: v39.68,55.24 39.68,51.91 42.86,48.73 43.18,48.73 IC5.55 | v45.4,56.83 49.68,56.83 52.07,59.21 54.13,59.21 54.76,59.84 RN1.4 | v41.27,61.59 40.64,62.22 40.64,63.18 41.59,64.13 OK3.5
  Bottom 0.203: v39.68,55.24 40.32,55.24 40.79,55.71 44.29,55.71 v45.4,56.83 45.24,57.3 45.24,57.94 41.59,61.59 v41.27,61.59
N$81  (via drill 0.61)
  Top 0.203: v49.37,50.79 48.73,50.79 45.87,47.94 44.13,47.94 IC5.56 | OK4.5 58.1,64.13 58.1,62.7 57.94,62.54 57.94,61.91 RN1.5
  Bottom 0.203: v49.37,50.79 49.37,53.17 55.4,59.21 56.51,59.21 57.3,60 RN1.5
N$82  (via drill 0.61)
  Top 0.203: v54.45,65.88 50.95,62.38 47.14,62.38 45.72,60.95 42.54,60.95 38.73,57.14 38.73,51.27 42.86,47.14 43.18,47.14 IC5.57 | OK5.5 74.45,64.29 73.5,64.29 71.59,62.38 61.43,62.38 60.8,61.75 RN1.6
  Bottom 0.203: v54.45,65.88 55.4,66.83 61.43,66.83 61.91,66.35 61.91,62.86 60.8,61.75 RN1.6
N$83  (via drill 0.61)
  Top 0.203: v52.07,51.59 48.73,48.25 48.1,48.25 45.87,46.03 44.92,46.03 44.76,46.19 44.13,46.19 IC5.58 | v87.94,61.75 87.94,61.27 79.69,53.02 70.96,53.02 66.35,57.62 v63.18,57.62
  Bottom 0.203: v52.07,51.59 52.07,53.49 57.3,58.73 61.27,58.73 62.38,59.84 RN1.7 63.18,59.68 v63.18,57.62 | v87.94,61.75 90.48,64.29 90.96,64.29 OK6.5
N$84  (via drill 0.61)
  Top 0.203: 39.37,49.05 38.1,50.32 38.1,51.59 v37.78,51.91 | 39.37,49.05 42.86,45.55 43.18,45.55 IC5.59 | v118.9,36.82 107.63,48.09 107.63,64.13 OK7.5 | v118.58,28.73 117.47,28.73 112.07,23.33 44.76,23.33 38.89,29.2 38.25,29.2 35.08,32.38 v35.08,36.82 | v35.24,44.92 39.37,49.05
  Bottom 0.203: v37.78,51.91 38.57,51.91 40.95,54.29 41.91,54.29 44.45,51.75 45.4,51.75 46.35,52.7 46.35,62.54 51.11,67.3 61.59,67.3 65.08,63.81 65.08,61.91 RN1.8 | v118.9,36.82 118.9,36.19 120.49,34.6 120.49,30.63 v118.58,28.73 | v35.08,36.82 38.73,40.48 38.73,41.43 v35.24,44.92
N$85  (via drill 0.61)
  Top 0.203: v50,45.4 48.41,45.4 47.62,44.6 44.13,44.6 IC5.60 | v47.3,53.02 v50.48,53.02 | v63.81,63.81 v67.3,63.81 | v105.88,69.05 v125.88,69.05 | v82.55,88.1 82.55,75.88 73.5,66.83 71.91,66.83 v70.96,65.88
  Bottom 0.203: v50,45.4 45.87,49.52 45.72,49.52 45.08,50.16 45.08,50.79 v47.3,53.02 | v50.48,53.02 50.95,53.02 57.15,59.21 60.8,59.21 61.91,60.32 61.91,61.91 v63.81,63.81 | RN1.9 67.62,61.91 67.3,62.22 v67.3,63.81 67.62,64.13 69.37,65.88 v70.96,65.88 | v125.88,69.05 125.88,63.97 125.09,63.18 121.91,63.18 120.96,64.13 120.96,66.35 121.44,66.83 122.39,66.83 123.03,66.19 123.98,66.19 OK8.5 | v105.88,69.05 105.88,69.53 87.31,88.1 v82.55,88.1
N$86  (via drill 0.61)
  Top 0.203: v46.03,43.65 44.13,43.65 IC5.61 | v46.67,45.55 47.94,45.55 48.73,46.35 v57.15,46.35 | v66.67,45.4 v66.67,54.29 | v72.38,55.08 73.34,56.03 73.34,57.94 70.96,60.32 RN1.10 | v85.72,67.94 85.88,68.1 137.63,68.1 139.54,66.19 140.49,66.19 OK9.5 | v82.7,64.92 79.21,64.92 v76.04,61.75
  Bottom 0.203: v46.03,43.65 46.03,44.92 v46.67,45.55 | v57.15,46.35 60.64,46.35 61.59,45.4 v66.67,45.4 | v66.67,54.29 67.46,55.08 v72.38,55.08 | v82.7,64.92 v85.72,67.94 | v76.04,61.75 73.5,61.75 73.34,61.59 70.96,61.59 RN1.10
N$87  (via drill 0.61)
  Top 0.203: v50.64,51.75 49.05,51.75 46.83,49.52 44.13,49.52 IC5.54 | v79.21,50 84.29,55.08 97.94,55.08 100.01,57.14 IC4.3 100.64,58.25 101.28,58.25 IC4.2
  Bottom 0.203: v50.64,51.75 52.86,49.52 78.73,49.52 v79.21,50
N$88  (via drill 0.61)
  Top 0.203: v58.73,55.71 57.62,55.71 IC5.33 | v84.45,62.54 84.93,62.54 85.08,62.7 93.97,62.7 97.63,59.05 IC4.5 | v42.86,61.91 37.78,56.83 35.24,56.83 31.43,53.02 31.43,50.16 IC11.13
  Bottom 0.203: v58.73,55.71 62.54,55.71 66.35,59.52 66.35,63.49 | 66.35,63.49 66.35,64.13 69.05,66.83 75.4,66.83 76.51,65.72 76.51,64.13 78.1,62.54 v84.45,62.54 | v42.86,61.91 45.08,61.91 50.95,67.78 62.07,67.78 66.35,63.49
N$89  (via drill 0.61)
  Top 0.203: v76.83,50.63 76.83,47.62 73.18,43.97 66.19,43.97 63.18,46.98 59.69,46.98 IC5.24 | v76.83,53.97 v83.97,61.11 | v91.28,60.95 90.32,60 90.32,59.68 C13.2
  Bottom 0.203: v76.83,50.63 v76.83,53.97 | v83.97,61.11 88.58,56.51 Q1.1 90.48,60.95 v91.28,60.95
N$90  (via drill 0.61)
  Top 0.203: v75.08,43.49 66.03,43.49 63.34,46.19 59.69,46.19 IC5.23 | v77.62,43.49 82.55,48.41 88.74,48.41 C12.2 89.53,47.94 v89.53,45.55
  Bottom 0.203: v75.08,43.49 v77.62,43.49 | v89.53,45.55 89.53,46.35 Q1.2
N$91  (via drill 0.61)
  Top 0.203: v42.06,43.17 43.18,43.17 IC5.62 | v36.83,36.66 36.83,34.92 C14.2
  Bottom 0.203: v42.06,43.17 42.06,41.9 v36.83,36.66
N$92  (via drill 0.61)
  Top 0.203: C15.2 43.33,34.92 43.33,41.27 IC5.64 43.18,41.27 v40.16,41.27 | v28.73,48.41 28.73,51.59 30.16,53.02 30.16,57.14 L1.2
  Bottom 0.203: v28.73,48.41 33.02,48.41 v40.16,41.27
N$93
  Top 0.203: IC5.18 59.69,42.06 66.83,42.06 70.64,38.25 Q2.2
  Bottom 0.203: C17.2 72.86,37.94 71.59,37.94 Q2.2
N$94  (via drill 0.61)
  Top 0.203: v32.06,44.92 32.06,48.25 IC11.12 | v32.06,41.11 32.06,40.16 29.68,37.78 29.68,33.97 32.54,31.11 32.54,29.2 39.21,22.54 80.48,22.54 85.88,17.14 v85.88,15.23 | v116.83,25.71 116.83,26.35 118.26,27.77 120.01,27.77 121.44,29.2 121.44,30.79 122.55,31.9 v122.71,31.9 | v120.96,36.03 119.38,36.03 119.22,35.87 114.93,35.87 v102.55,48.25 | v101.28,49.52 101.28,51.11 IC4.13
  Bottom 0.203: v32.06,41.11 v32.06,44.92 | v85.88,15.23 88.42,12.69 101.44,12.69 106.52,17.77 108.9,17.77 v116.83,25.71 | v122.71,31.9 122.71,34.28 v120.96,36.03 | v102.55,48.25 v101.28,49.52
N$95
  Top 0.381: R21.1 13.33,75.24 13.33,73.97 OK1.1
N$96
  Top 0.381: 11.35,78.34 10.79,77.78 C2.+ | 11.35,78.34 11.58,78.58 12.38,78.58 R21.2 | D1.C 8.73,80.96 11.27,78.42 11.35,78.34
N$97
  Top 0.381: C1.2 15.24,89.37 15.24,86.35 D2.C 14.92,84.77 13.97,83.81 D1.A
N$98
  Top 0.381: R22.1 4.76,87.94 4.76,86.35 D2.A
  Bottom 0.381: 7.69,83.42 5.87,85.24 D2.A | 7.69,83.42 12.7,78.42 12.7,76.19 10.95,74.45 10.95,73.97 OK1.2 | C2.- 7.62,78.1 7.62,83.34 7.69,83.42
N$99
  Top 0.381: R23.2 26.98,76.03 26.19,76.03 25.39,76.83 C4.+ 25.08,78.1 23.97,79.21 23.97,80.96 D3.C
N$100
  Top 0.381: C3.2 30.47,89.37 30.47,86.35 D4.C 30.16,84.77 29.2,83.81 D3.A
N$101
  Top 0.381: R24.1 20,87.94 20,86.35 D4.A
  Bottom 0.381: 22.3,83.42 20.79,84.92 D4.A | 22.3,83.42 27.3,78.42 27.3,76.19 25.55,74.45 25.55,73.97 OK2.2 | C4.- 22.22,78.1 22.22,83.34 22.3,83.42
N$102
  Top 0.381: 42.7,78.58 43.49,78.58 R25.2 | 42.7,78.58 41.91,77.78 C6.+ | D5.C 40.48,80.96 42.7,78.73 42.7,78.58
N$103
  Top 0.381: C5.2 46.98,89.37 46.98,86.35 D6.C 46.67,84.77 45.72,83.81 D5.A
N$104
  Top 0.381: R26.1 36.51,87.94 36.51,86.35 D6.A
  Bottom 0.381: 38.81,83.42 37.3,84.92 D6.A | 38.81,83.42 43.81,78.42 43.81,76.19 42.06,74.45 42.06,73.97 OK3.2 | C6.- 38.73,78.1 38.73,83.34 38.81,83.42
N$105
  Top 0.381: 59.21,78.58 60,78.58 R27.2 | 59.21,78.58 58.41,77.78 C8.+ | D7.C 56.99,80.96 59.21,78.73 59.21,78.58
N$106
  Bottom 0.203: DISP.3 24.12,41.43 23.49,41.43 22.38,40.32 8.41,40.32 2.85,34.76 2.85,31.9 R18.S
N$107
  Top 0.381: C7.2 63.5,89.37 63.5,86.35 D8.C 63.18,84.77 62.23,83.81 D7.A
N$108
  Top 0.381: R28.1 53.02,87.94 53.02,86.35 D8.A
  Bottom 0.381: 55.32,83.42 53.81,84.92 D8.A | 55.32,83.42 60.32,78.42 60.32,76.19 58.57,74.45 58.57,73.97 OK4.2 | C8.- 55.24,78.1 55.24,83.34 55.32,83.42
N$109
  Top 0.381: 75.72,78.58 75.4,78.58 74.45,77.62 C10.+ | 75.72,78.58 76.51,78.58 R29.2 | D9.C 73.5,80.96 75.72,78.73 75.72,78.58
N$110
  Top 0.381: C9.2 79.69,89.37 79.69,86.35 D10.C 79.69,84.77 78.73,83.81 D9.A
N$111
  Top 0.381: R30.1 69.53,87.94 69.53,86.35 D10.A
  Bottom 0.381: 71.19,83.73 70.16,84.77 D10.A | 71.19,83.73 76.19,78.73 76.19,76.19 75.08,75.08 75.08,73.97 OK5.2 | C10.- 71.11,78.1 71.11,83.66 71.19,83.73
N$112
  Top 0.381: 92.23,78.58 93.02,78.58 R31.2 | 92.23,78.58 91.44,77.78 C19.+ | D11.C 90.01,80.96 92.23,78.73 92.23,78.58
N$113
  Top 0.381: C11.2 96.52,89.37 96.52,86.35 D12.C 96.2,84.77 95.24,83.81 D11.A
N$114
  Top 0.203: R19.2 30,60.48 28.57,60.48 25.39,57.3 DISP.15
N$115  (via drill 0.61)
  Top 0.203: v109.69,44.76 109.69,45.4 106.36,48.73 106.36,49.52 v103.98,51.91 | v30.79,64.61 22.86,56.67 DISP.16
  Bottom 0.203: v109.69,44.76 109.69,39.05 109.21,38.57 109.06,38.57 108.74,38.25 IC3.14 | v103.98,51.91 103.98,60.32 94.93,69.37 35.55,69.37 v30.79,64.61
N$116
  Top 0.381: R32.1 86.04,87.94 86.04,86.35 D12.A
  Bottom 0.381: 88.34,83.42 86.83,84.92 D12.A | 88.34,83.42 93.34,78.42 93.34,76.19 91.59,74.45 91.59,73.97 OK6.2 | C19.- 88.26,78.1 88.26,83.34 88.34,83.42
N$117
  Top 0.381: 108.74,78.58 109.53,78.58 R33.2 | 108.74,78.58 107.94,77.78 C21.+ | D13.C 106.52,80.96 108.74,78.73 108.74,78.58
N$118
  Top 0.381: C20.2 113.02,89.37 113.02,86.35 D14.C 112.71,84.77 111.75,83.81 D13.A
N$119
  Top 0.381: R34.1 102.55,87.94 102.55,86.35 D14.A
  Bottom 0.381: 104.85,83.42 103.34,84.92 D14.A | 104.85,83.42 109.85,78.42 109.85,76.19 108.1,74.45 108.1,73.97 OK7.2 | C21.- 104.77,78.1 104.77,83.34 104.85,83.42
N$120
  Top 0.381: 125.88,77.94 124.3,77.94 C24.+ | 125.88,77.94 126.04,77.94 R35.2 | D15.C 123.03,80.96 125.88,78.1 125.88,77.94
N$121
  Top 0.381: C22.2 129.53,89.37 129.53,86.35 D16.C 129.22,84.77 128.27,83.81 D15.A
N$122
  Top 0.381: R36.1 119.06,87.94 119.06,86.35 D16.A
  Bottom 0.381: 121.36,83.42 119.85,84.92 D16.A | 121.36,83.42 126.36,78.42 126.36,76.19 124.61,74.45 124.61,73.97 OK8.2 | C24.- 121.28,78.1 121.28,83.34 121.36,83.42
N$123
  Top 0.381: 141.76,78.58 142.55,78.58 R37.2 | 141.76,78.58 140.97,77.78 C26.+ | D17.C 139.54,80.96 141.76,78.73 141.76,78.58
N$124
  Top 0.381: C25.2 146.04,89.37 146.04,86.35 D18.C 145.73,84.77 144.78,83.81 D17.A
N$125
  Top 0.381: R38.1 135.57,87.94 135.57,86.35 D18.A
  Bottom 0.381: 137.87,83.42 136.36,84.92 D18.A | 137.87,83.42 142.87,78.42 142.87,76.19 141.12,74.45 141.12,73.97 OK9.2 | C26.- 137.79,78.1 137.79,83.34 137.87,83.42
N$126  (via drill 0.61)
  Top 0.381: R22.2 5.39,92.07 6.19,92.07 6.66,92.55 18.25,92.55 18.73,92.07 R24.2 20.63,92.07 21.11,92.55 31.43,92.55 31.9,92.07 35.24,92.07 R26.2 37.14,92.07 37.94,92.07 v39.21,93.34 | X23.2 134.93,94.61 134.93,92.07 R38.2 134.3,92.07 130.96,92.07 130.49,92.55 120.17,92.55 119.69,92.07 R36.2 117.79,92.07 114.45,92.07 113.98,92.55 103.66,92.55 103.18,92.07 R34.2 101.28,92.07 100.8,92.55 87.94,92.55 87.47,92.07 86.67,92.07 R32.2 84.77,91.43 v82.86,93.34 | v71.59,93.34 70.32,92.07 69.53,92.07 R30.2 67.62,92.07 67.15,92.55 54.92,92.55 54.45,92.07 53.65,92.07 R28.2 51.75,91.43 v49.84,93.34
  Bottom 0.381: v71.59,93.34 v82.86,93.34 | v39.21,93.34 v49.84,93.34
N$127
  Bottom 0.381: C1.1 8.25,90.32 13.49,95.56 X19.1
N$128  (via drill 0.61)
  Top 0.203: v4.92,40 4.92,38.73 SJ1.2 | v16.82,48.09 22.06,53.33 25.24,53.33 29.52,57.62 29.52,58.1 31.9,60.48 35.08,60.48 R19.1
  Bottom 0.203: v4.92,40 10.31,45.4 12.38,45.4 15.08,48.09 v16.82,48.09
N$129
  Bottom 0.381: C3.1 22.54,90.64 22.54,92.07 19.36,95.24 X19.2
N$130
  Top 0.381: C5.1 40,90.32 46.19,96.51 X20.1
N$131
  Bottom 0.381: C7.1 55.56,90.64 55.56,92.07 52.38,95.24 X20.2
N$132
  Top 0.381: C9.1 72.38,90.32 79.21,97.15 X21.1
N$133
  Bottom 0.381: C11.1 88.58,90.64 88.58,92.07 85.4,95.24 X21.2
N$134
  Bottom 0.381: C20.1 106.04,90.32 112.23,96.51 X22.1
N$135
  Bottom 0.381: C22.1 121.6,90.64 121.6,92.07 118.42,95.24 X22.2
N$136
  Bottom 0.381: C25.1 137.79,90.32 135.09,90.32 130.33,95.08 X23.1
N$137
  Top 0.203: S2.3 16.03,54.92 16.03,56.51 S1.4
N$138
  Top 0.203: S3.3 14.92,47.3 10.47,51.75 10.47,53.49 S2.4
N$139  (via drill 0.61)
  Top 0.203: v48.73,42.54 49.68,41.59 49.68,40.95 49.53,40.79 49.53,40.16 IC5.6 | v45.24,46.98 46.19,46.98 v48.41,49.21 | v50.16,63.34 49.68,63.34 49.21,62.86 v41.59,62.86
  Bottom 0.203: v48.73,42.54 45.87,42.54 45.08,43.33 45.08,46.82 v45.24,46.98 | v48.41,49.21 48.41,56.98 51.11,59.68 51.11,62.38 v50.16,63.34 | v41.59,62.86 18.25,62.86 17.46,62.06 S1.2
N$140  (via drill 0.61)
  Top 0.203: v50,38.09 50.16,38.25 50.16,39.2 IC5.7 | v51.91,38.09 51.91,34.28 50.32,32.7 39.05,32.7 37.78,33.97 v37.78,40.79 | v26.03,45.87 25.39,45.87 24.92,45.4 14.6,45.4 10.79,49.21 S2.2
  Bottom 0.203: v51.91,38.09 v50,38.09 | v37.78,40.79 32.7,45.87 v26.03,45.87
N$141
  Top 0.203: IC5.1 45.56,39.2 45.56,38.73 49.21,35.08 R20.1
N$142  (via drill 0.61)
  Top 0.203: v50.64,34.28 50.95,34.6 50.95,39.2 IC5.8 | v11.43,36.51 11.43,40.32 10.47,41.27 S3.2
  Bottom 0.203: v50.64,34.28 33.33,34.28 32.38,33.33 14.6,33.33 v11.43,36.51
N$143  (via drill 0.61)
  Top 0.203: v55.4,41.11 52.54,41.11 51.91,40.48 51.91,40.16 IC5.9
  Bottom 0.203: v55.4,41.11 58.41,38.09 58.41,36.66 55.08,33.33 51.27,33.33 50.8,32.85 33.17,32.85 32.22,31.9 13.17,31.9 10.95,34.12 S4.2
N$144
  Top 0.203: R37.1 143.5,75.24 143.5,73.97 OK9.1
N$145
  Top 0.203: R35.1 126.99,74.61 126.99,73.97 OK8.1
N$146
  Top 0.203: R33.1 110.48,75.24 110.48,73.97 OK7.1
N$147
  Top 0.203: R31.1 93.97,75.24 93.97,73.97 OK6.1
N$148
  Top 0.203: R29.1 77.46,75.24 77.46,73.97 OK5.1
N$149
  Top 0.203: R27.1 60.96,75.24 60.96,73.97 OK4.1
N$150
  Top 0.203: R25.1 44.45,75.24 44.45,73.97 OK3.1
N$151
  Top 0.203: R23.1 28.89,78.42 29.68,78.42 30.63,77.46 30.63,74.29 28.41,72.07 OK2.1
N$152
  Bottom 0.203: R151.1 154.14,67.3 152.87,67.3 OX4.2
N$153  (via drill 0.61)
  Top 0.203: v73.81,45.87 69.37,50.32 69.37,53.97 67.15,56.19 62.38,56.19 61.91,56.67 57.46,56.67 56.83,56.03 56.83,55.71 IC5.34 | v78.1,45.87 v80.48,48.25
  Bottom 0.203: v73.81,45.87 v78.1,45.87 | v80.48,48.25 80.8,48.25 85.4,43.65 85.72,43.65 86.2,43.17 IC2.4
N$154  (via drill 0.61)
  Top 0.203: v68.57,63.81 64.13,68.26 59.37,68.26 56.83,65.72 56.83,60.32 55.24,58.73 52.22,58.73 49.53,56.03 49.53,55.71 IC5.43
  Bottom 0.203: v68.57,63.81 68.57,62.22 69.53,61.27 69.53,59.68 70,59.21 72.07,59.21 73.66,60.8 83.02,60.8 87.31,56.51 87.31,43.17 IC2.5
N$155
  Top 0.203: B1.AC2 119.22,45.87 121.44,43.65 TR1.9
N$156
  Bottom 0.203: B1.AC1 119.06,41.59 119.06,45.08 122.55,48.57 122.55,51.27 TR1.7
N$157
  Top 0.203: B1.+ 110.8,46.67 110.8,48.09 108.1,50.79 108.1,58.57 108.9,59.37 C29.+
  Bottom 0.203: C29.+ 110.01,60.32 110.33,60.32 C27.1 111.91,59.52 114.14,59.52 IC6.IN
N$186  (via drill 0.61)
  Top 0.203: v56.51,36.51 56.51,39.2 IC5.15 | v30.63,37.46 v30.63,34.76
  Bottom 0.203: v56.51,36.51 55.88,36.51 54.61,35.24 41.75,35.24 41.27,34.76 33.17,34.76 32.22,33.81 31.59,33.81 v30.63,34.76 | v30.63,37.46 25.24,42.86 23.65,42.86 22.86,42.06 DISP.4
N$203  (via drill 0.61)
  Top 0.203: v57.46,37.78 57.46,39.2 IC5.16 | v31.9,34.76 v31.9,37.46
  Bottom 0.203: v57.46,37.78 56.51,37.78 54.61,35.87 41.75,35.87 41.11,35.24 32.38,35.24 v31.9,34.76 | v31.9,37.46 25.39,43.97 DISP.5
N$205  (via drill 0.61)
  Top 0.203: v52.86,26.66 58.73,32.54 58.73,41.27 IC5.17 | v27.46,26.66 27.46,30 19.04,38.41 19.04,40.79 21.9,43.65 DISP.6
  Bottom 0.203: v27.46,26.66 v52.86,26.66
N$206  (via drill 0.61)
  Top 0.203: v43.33,57.62 45.24,55.71 IC5.48
  Bottom 0.203: v43.33,57.62 42.06,57.62 40.79,58.89 28.25,58.89 24.92,55.56 23.65,55.56 22.86,54.76 DISP.14
N$207  (via drill 0.61)
  Top 0.203: v41.43,53.33 43.18,53.33 IC5.49
  Bottom 0.203: v41.43,53.33 40.64,53.33 38.25,50.95 27.93,50.95 25.08,53.81 DISP.13
N$208  (via drill 0.61)
  Top 0.203: v45.08,52.7 44.13,52.7 IC5.50 | v27.3,52.86 25.24,50.79 23.65,50.79 22.86,51.59 DISP.12
  Bottom 0.203: v45.08,52.7 44.13,52.7 42.06,54.76 40.48,54.76 38.57,52.86 v27.3,52.86
N$209  (via drill 0.61)
  Top 0.203: v41.59,52.06 43.18,52.06 IC5.51
  Bottom 0.203: v41.59,52.06 40,52.06 38.41,50.48 26.51,50.48 25.39,51.59 DISP.11
N$219  (via drill 0.61)
  Top 0.203: v45.08,41.43 46.03,40.48 46.03,40.16 IC5.2 | v9.36,51.75 3.49,57.62 JP2.4
  Bottom 0.203: v45.08,41.43 37.14,49.37 26.35,49.37 25.24,48.25 20.47,48.25 16.98,51.75 v9.36,51.75 | JP1.4 2.85,46.19 2.85,46.82 0.63,49.05 0.63,56.83 1.42,57.62 JP2.4
N$231  (via drill 0.61)
  Top 0.203: v108.74,63.49 141.28,63.49 141.92,64.13 141.92,66.19 152.24,76.51 152.24,77.46 OX3.3 | v100.8,61.59 v102.71,63.49
  Bottom 0.203: L7.2 95.56,49.21 98.42,52.06 98.42,60.64 C66.2 99.85,61.59 v100.8,61.59 | v102.71,63.49 v108.74,63.49